# Altium schematic sheet DM1090FFC_TopLevel.SchDoc: =project_title
size Tabloid; PageSetup: Record=PageOptions|CenterHorizontal=True|CenterVertical=True|PrintScale=0.73|XCorrection=1.00|YCorrection=1.00|PrintKind=0|BorderSize=5000000|LeftOffset=0|BottomOffset=0|Orientation=2|PaperLength=1000|PaperWidth=1000|Scale=100|PaperSource=7|PrintQuality=-4|MediaType=1|DitherType=10|PaperKind=A4|PrintScaleMode=1; CompanyName: Luxonis Holding; Organization: Luxonis Holding; Address1: 1925 Harmony Park Drive; Address2: Westminster, CO; Address3: 80234; Address4: United States; SheetNumber: 2; SheetTotal: 5
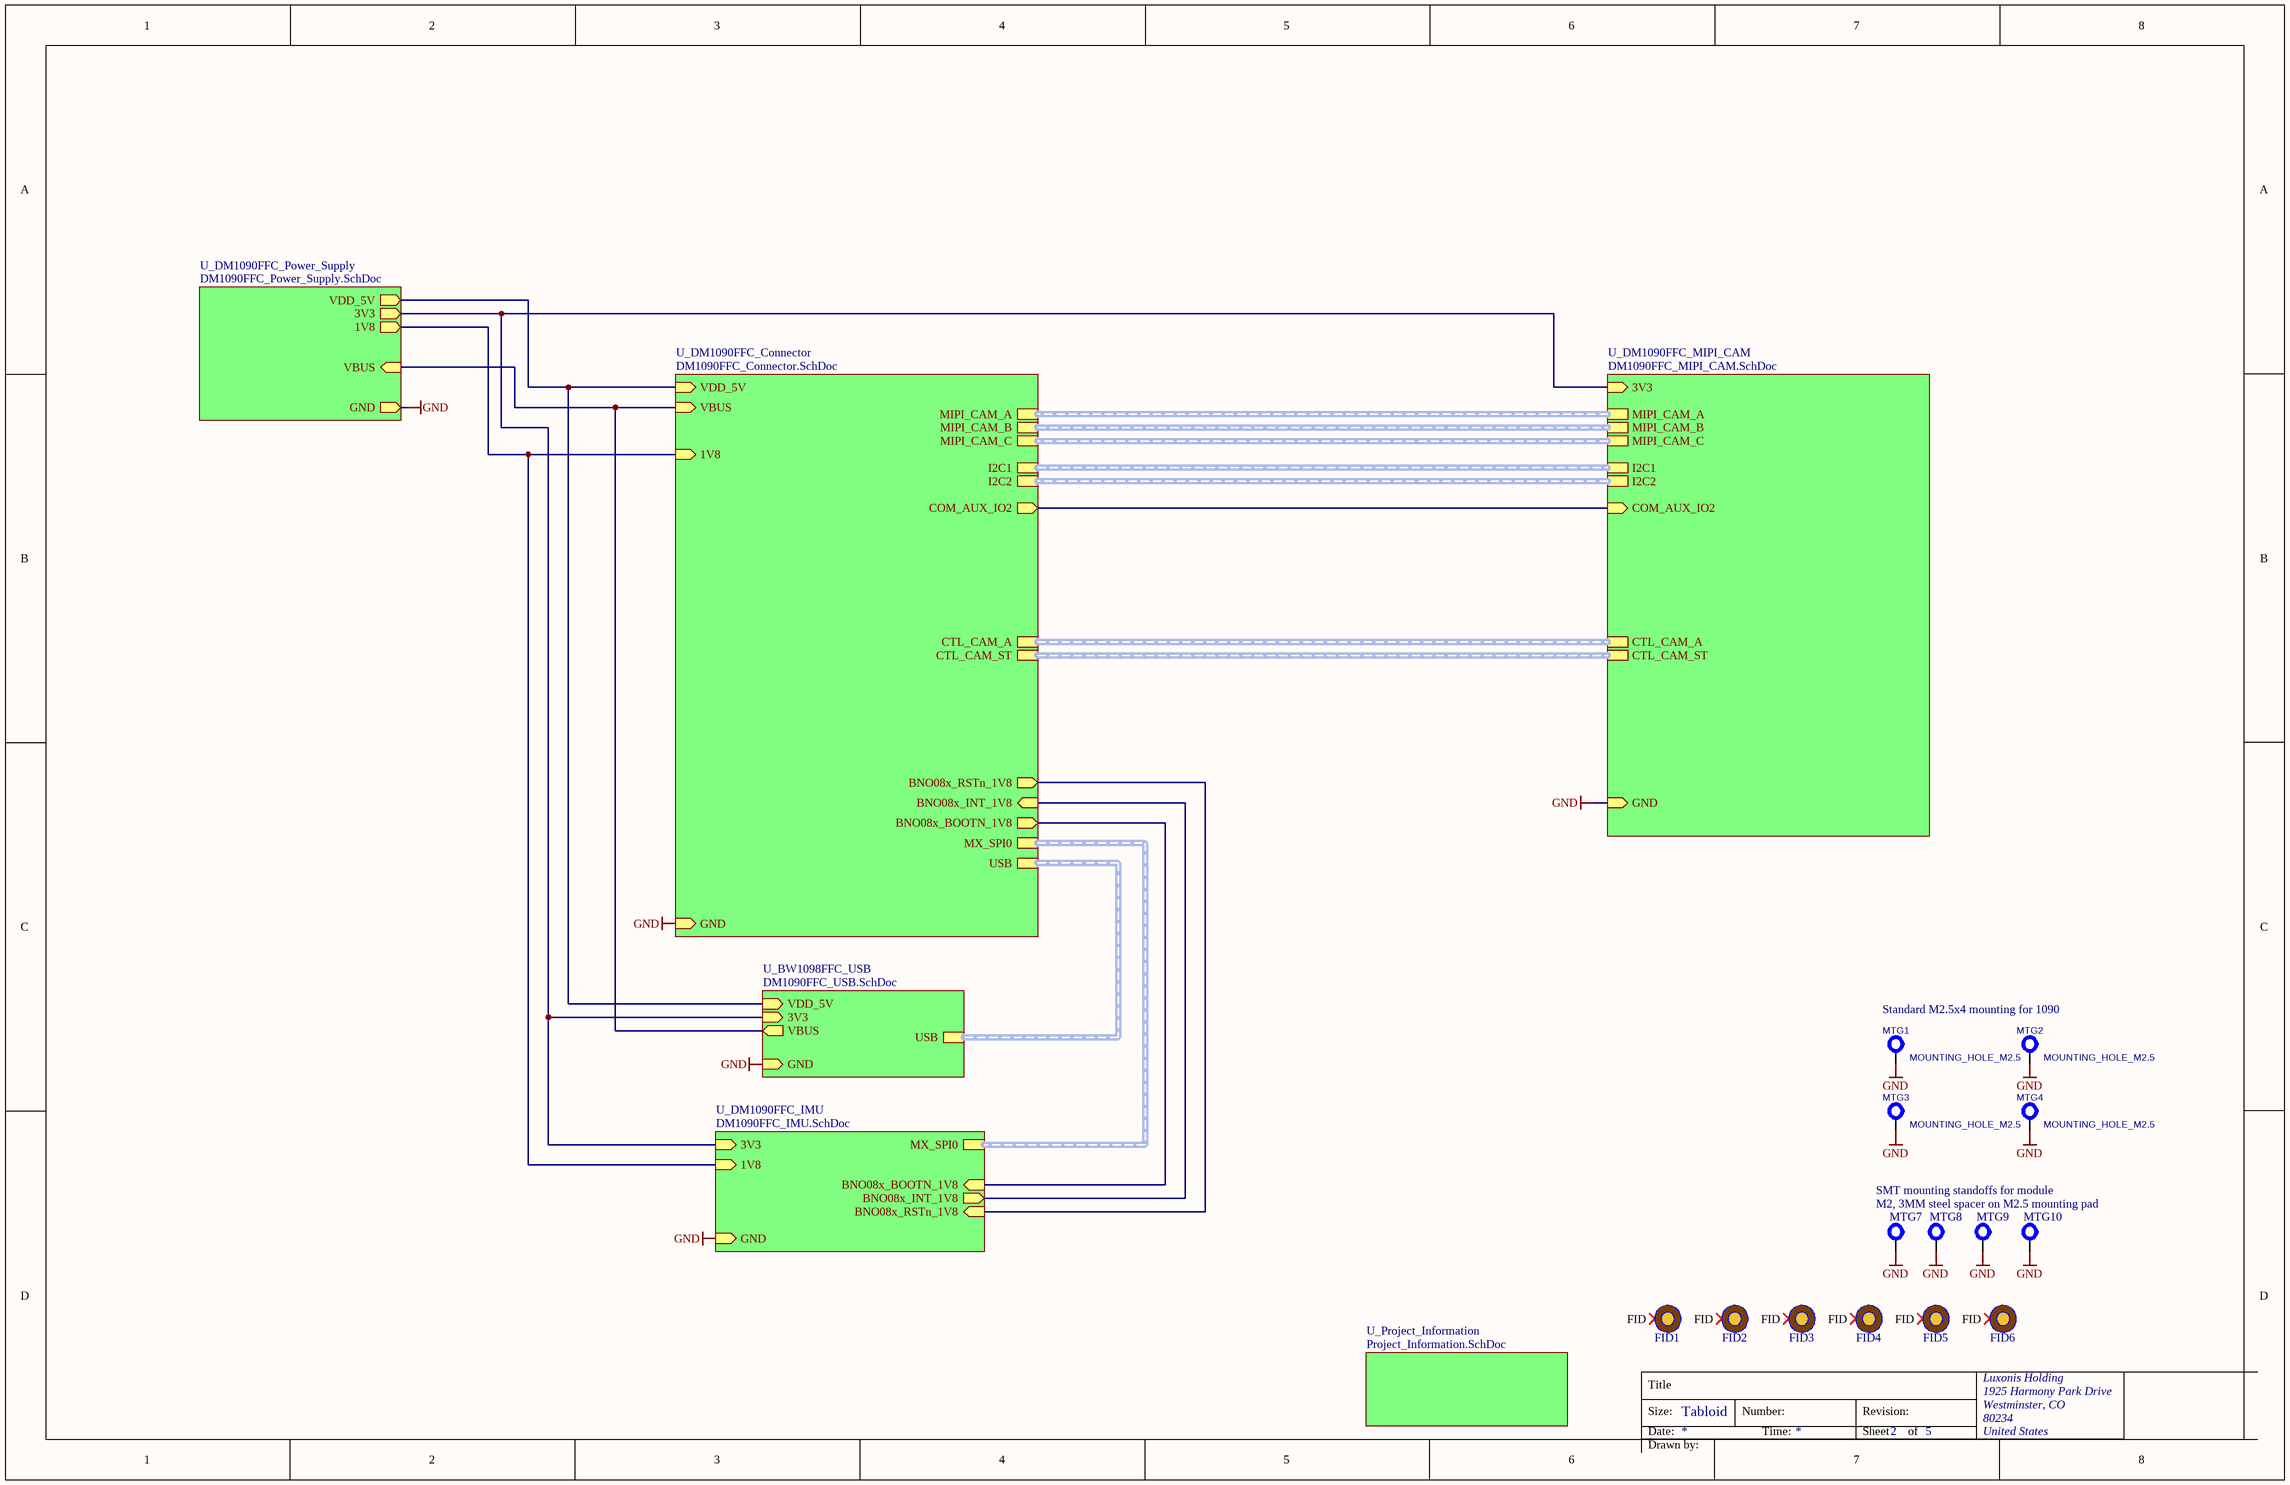
[diagram p0: DM1090FFC_TopLevel.SchDoc]

## Parts
FID1  FIDUCIAL_ROUND_1MM  [FIDUCIAL_ROUND_1MM]  (value not drawn)  (no BOM)
FID2  FIDUCIAL_ROUND_1MM  [FIDUCIAL_ROUND_1MM]  (value not drawn)  (no BOM)
FID3  FIDUCIAL_ROUND_1MM  [FIDUCIAL_ROUND_1MM]  (value not drawn)  (no BOM)
FID4  FIDUCIAL_ROUND_1MM  [FIDUCIAL_ROUND_1MM]  (value not drawn)  (no BOM)
FID5  FIDUCIAL_ROUND_1MM  [FIDUCIAL_ROUND_1MM]  (value not drawn)  (no BOM)
FID6  FIDUCIAL_ROUND_1MM  [FIDUCIAL_ROUND_1MM]  (value not drawn)  (no BOM)
MTG1  MOUNTING_HOLE_M2.5  [MOUNTING_HOLE_M2.5]  (no BOM)
MTG2  MOUNTING_HOLE_M2.5  [MOUNTING_HOLE_M2.5]  (no BOM)
MTG3  MOUNTING_HOLE_M2.5  [MOUNTING_HOLE_M2.5]  (no BOM)
MTG4  MOUNTING_HOLE_M2.5  [MOUNTING_HOLE_M2.5]  (no BOM)
MTG7  M2, 3MM steel spacer on M2.5 mounting pad  [9774030243R]
MTG8  M2, 3MM steel spacer on M2.5 mounting pad  [9774030243R]  (value not drawn)
MTG9  M2, 3MM steel spacer on M2.5 mounting pad  [9774030243R]  (value not drawn)
MTG10  M2, 3MM steel spacer on M2.5 mounting pad  [9774030243R]  (value not drawn)

## Sub-sheets
U_BW1098FFC_USB = DM1090FFC_USB.SchDoc: VBUS (out), GND (in), 3V3 (in), VDD_5V (in), USB (harness USB)
U_DM1090FFC_Connector = DM1090FFC_Connector.SchDoc: MIPI_CAM_B (harness MIPI_CAM_B), MIPI_CAM_A (harness MIPI_CAM_A), MIPI_CAM_C (harness MIPI_CAM_C), I2C2 (harness I2C2), I2C1 (harness I2C1), VDD_5V (in), GND (in), VBUS (in), CTL_CAM_ST (harness CTL_CAM_B), CTL_CAM_A (harness CTL_CAM_A), USB (harness USB), MX_SPI0 (harness MX_SPI0), BNO08x_RSTn_1V8 (out), BNO08x_INT_1V8 (in), BNO08x_BOOTN_1V8 (out), 1V8 (in), COM_AUX_IO2 (out)
U_DM1090FFC_IMU = DM1090FFC_IMU.SchDoc: BNO08x_BOOTN_1V8 (in), GND (in), 3V3 (in), BNO08x_INT_1V8 (out), BNO08x_RSTn_1V8 (in), 1V8 (in), MX_SPI0 (harness MX_SPI0)
U_DM1090FFC_MIPI_CAM = DM1090FFC_MIPI_CAM.SchDoc: MIPI_CAM_B (harness MIPI_CAM_B), I2C2 (harness I2C2), I2C1 (harness I2C1), MIPI_CAM_A (harness MIPI_CAM_A), MIPI_CAM_C (harness MIPI_CAM_C), GND (in), 3V3 (in), COM_AUX_IO2 (in), CTL_CAM_A, CTL_CAM_ST
U_DM1090FFC_Power_Supply = DM1090FFC_Power_Supply.SchDoc: GND (out), 1V8 (out), VDD_5V (out), 3V3 (out), VBUS (in)
U_Project_Information = Project_Information.SchDoc: no entries

## Nets
GND: MTG1.1 MTG2.1 MTG3.1 MTG4.1 MTG7.1 MTG8.1 MTG9.1 MTG10.1 ; sheet U_DM1090FFC_Connector/GND, sheet U_BW1098FFC_USB/GND, sheet U_DM1090FFC_MIPI_CAM/GND, sheet U_DM1090FFC_Power_Supply/GND, sheet U_DM1090FFC_IMU/GND
(unnamed): sheet U_DM1090FFC_Connector/VDD_5V, sheet U_BW1098FFC_USB/VDD_5V, sheet U_DM1090FFC_Power_Supply/VDD_5V
(unnamed): sheet U_DM1090FFC_Connector/VBUS, sheet U_BW1098FFC_USB/VBUS, sheet U_DM1090FFC_Power_Supply/VBUS
(unnamed): sheet U_DM1090FFC_Connector/BNO08x_RSTn_1V8, sheet U_DM1090FFC_IMU/BNO08x_RSTn_1V8
(unnamed): sheet U_DM1090FFC_Connector/BNO08x_INT_1V8, sheet U_DM1090FFC_IMU/BNO08x_INT_1V8
(unnamed): sheet U_DM1090FFC_Connector/BNO08x_BOOTN_1V8, sheet U_DM1090FFC_IMU/BNO08x_BOOTN_1V8
(unnamed): sheet U_DM1090FFC_Connector/1V8, sheet U_DM1090FFC_Power_Supply/1V8, sheet U_DM1090FFC_IMU/1V8
(unnamed): sheet U_DM1090FFC_Connector/COM_AUX_IO2, sheet U_DM1090FFC_MIPI_CAM/COM_AUX_IO2
(unnamed): sheet U_BW1098FFC_USB/3V3, sheet U_DM1090FFC_MIPI_CAM/3V3, sheet U_DM1090FFC_Power_Supply/3V3, sheet U_DM1090FFC_IMU/3V3

Not connected (* = marked no-connect by the designer): FID1 FID*; FID2 FID*; FID3 FID*; FID4 FID*; FID5 FID*; FID6 FID*

## Buses and harness runs
harness sheet U_BW1098FFC_USB/USB = sheet U_DM1090FFC_Connector/USB
harness sheet U_DM1090FFC_Connector/CTL_CAM_A = sheet U_DM1090FFC_MIPI_CAM/CTL_CAM_A
harness sheet U_DM1090FFC_Connector/CTL_CAM_ST = sheet U_DM1090FFC_MIPI_CAM/CTL_CAM_ST
harness sheet U_DM1090FFC_Connector/I2C1 = sheet U_DM1090FFC_MIPI_CAM/I2C1
harness sheet U_DM1090FFC_Connector/I2C2 = sheet U_DM1090FFC_MIPI_CAM/I2C2
harness sheet U_DM1090FFC_Connector/MIPI_CAM_A = sheet U_DM1090FFC_MIPI_CAM/MIPI_CAM_A
harness sheet U_DM1090FFC_Connector/MIPI_CAM_B = sheet U_DM1090FFC_MIPI_CAM/MIPI_CAM_B
harness sheet U_DM1090FFC_Connector/MIPI_CAM_C = sheet U_DM1090FFC_MIPI_CAM/MIPI_CAM_C
harness sheet U_DM1090FFC_Connector/MX_SPI0 = sheet U_DM1090FFC_IMU/MX_SPI0

## Notes on the sheet
- Standard M2.5x4 mounting for 1090
- SMT mounting standoffs for module
- Title
- Size:
- Date:
- Tabloid
- Number:
- Time:
- Revision:
- Sheet
- of
- Drawn by:

## Library data of the parts
FID1-FID6 = FIDUCIAL: Fiducial with various available footprints
MTG1-MTG4 = MP_Mounting-Holes: =CurrentFootprint; B - Value: Not a Part; A - Level: 0
MTG7-MTG10 = 9774030243R: MP ROUND STANDOFF M2X0.4 STEEL 3MM; Manufacturer 1: Wurth Electronics; Plating: Tin; Threaded/Unthreaded: Threaded; Outside Diameter: 0.171inch; Supplier 1: Digi-Key; Manufacturer Part Number 1: 9774030243R; Stock 1: 20568; Pricing 1: 1=0.95000, 10=0.91800, 50=0.79500, 100=0.73900 (USD); RoHS: Yes; Material: Steel; Length: 0.173inch; REACH SVHC: Unknown; ComponentLink1URL: http://www.mouser.com/ds/2/445/9774030243R-611455.pdf?src-supplier=Mouser; ComponentLink1Description: http://www.mouser.com/ds/2/445/9774030243R-611455.pdf?src-supplier=Mouser; ComponentLink2URL: http://www.farnell.com/datasheets/1960368.pdf?src-supplier=Farnell; ComponentLink2Description: http://www.farnell.com/datasheets/1960368.pdf?src-supplier=Farnell; ComponentLink3URL: https://katalog.we-online.de/em/datasheet/9774030243R.pdf?src-supplier=Digi-Key; ComponentLink3Description: https://katalog.we-online.de/em/datasheet/9774030243R.pdf?src-supplier=Digi-Key; ComponentLink4URL: http://www.farnell.com/datasheets/1960368.pdf?src-supplier=Newark; ComponentLink4Description: http://www.farnell.com/datasheets/1960368.pdf?src-supplier=Newark; ComponentLink5URL: http://www.farnell.com/datasheets/1960368.pdf?src-supplier=Element14; ComponentLink5Description: http://www.farnell.com/datasheets/1960368.pdf?src-supplier=Element14; Supplier Part Number 1: 732-7085-1-ND; Supplier 2: Mouser; Supplier Part Number 2: 710-9774030243R; Supplier 3: Element14; Supplier Part Number 3: 2497599